# Altium schematic sheet RodManipulator_SCH.SchDoc
size A3
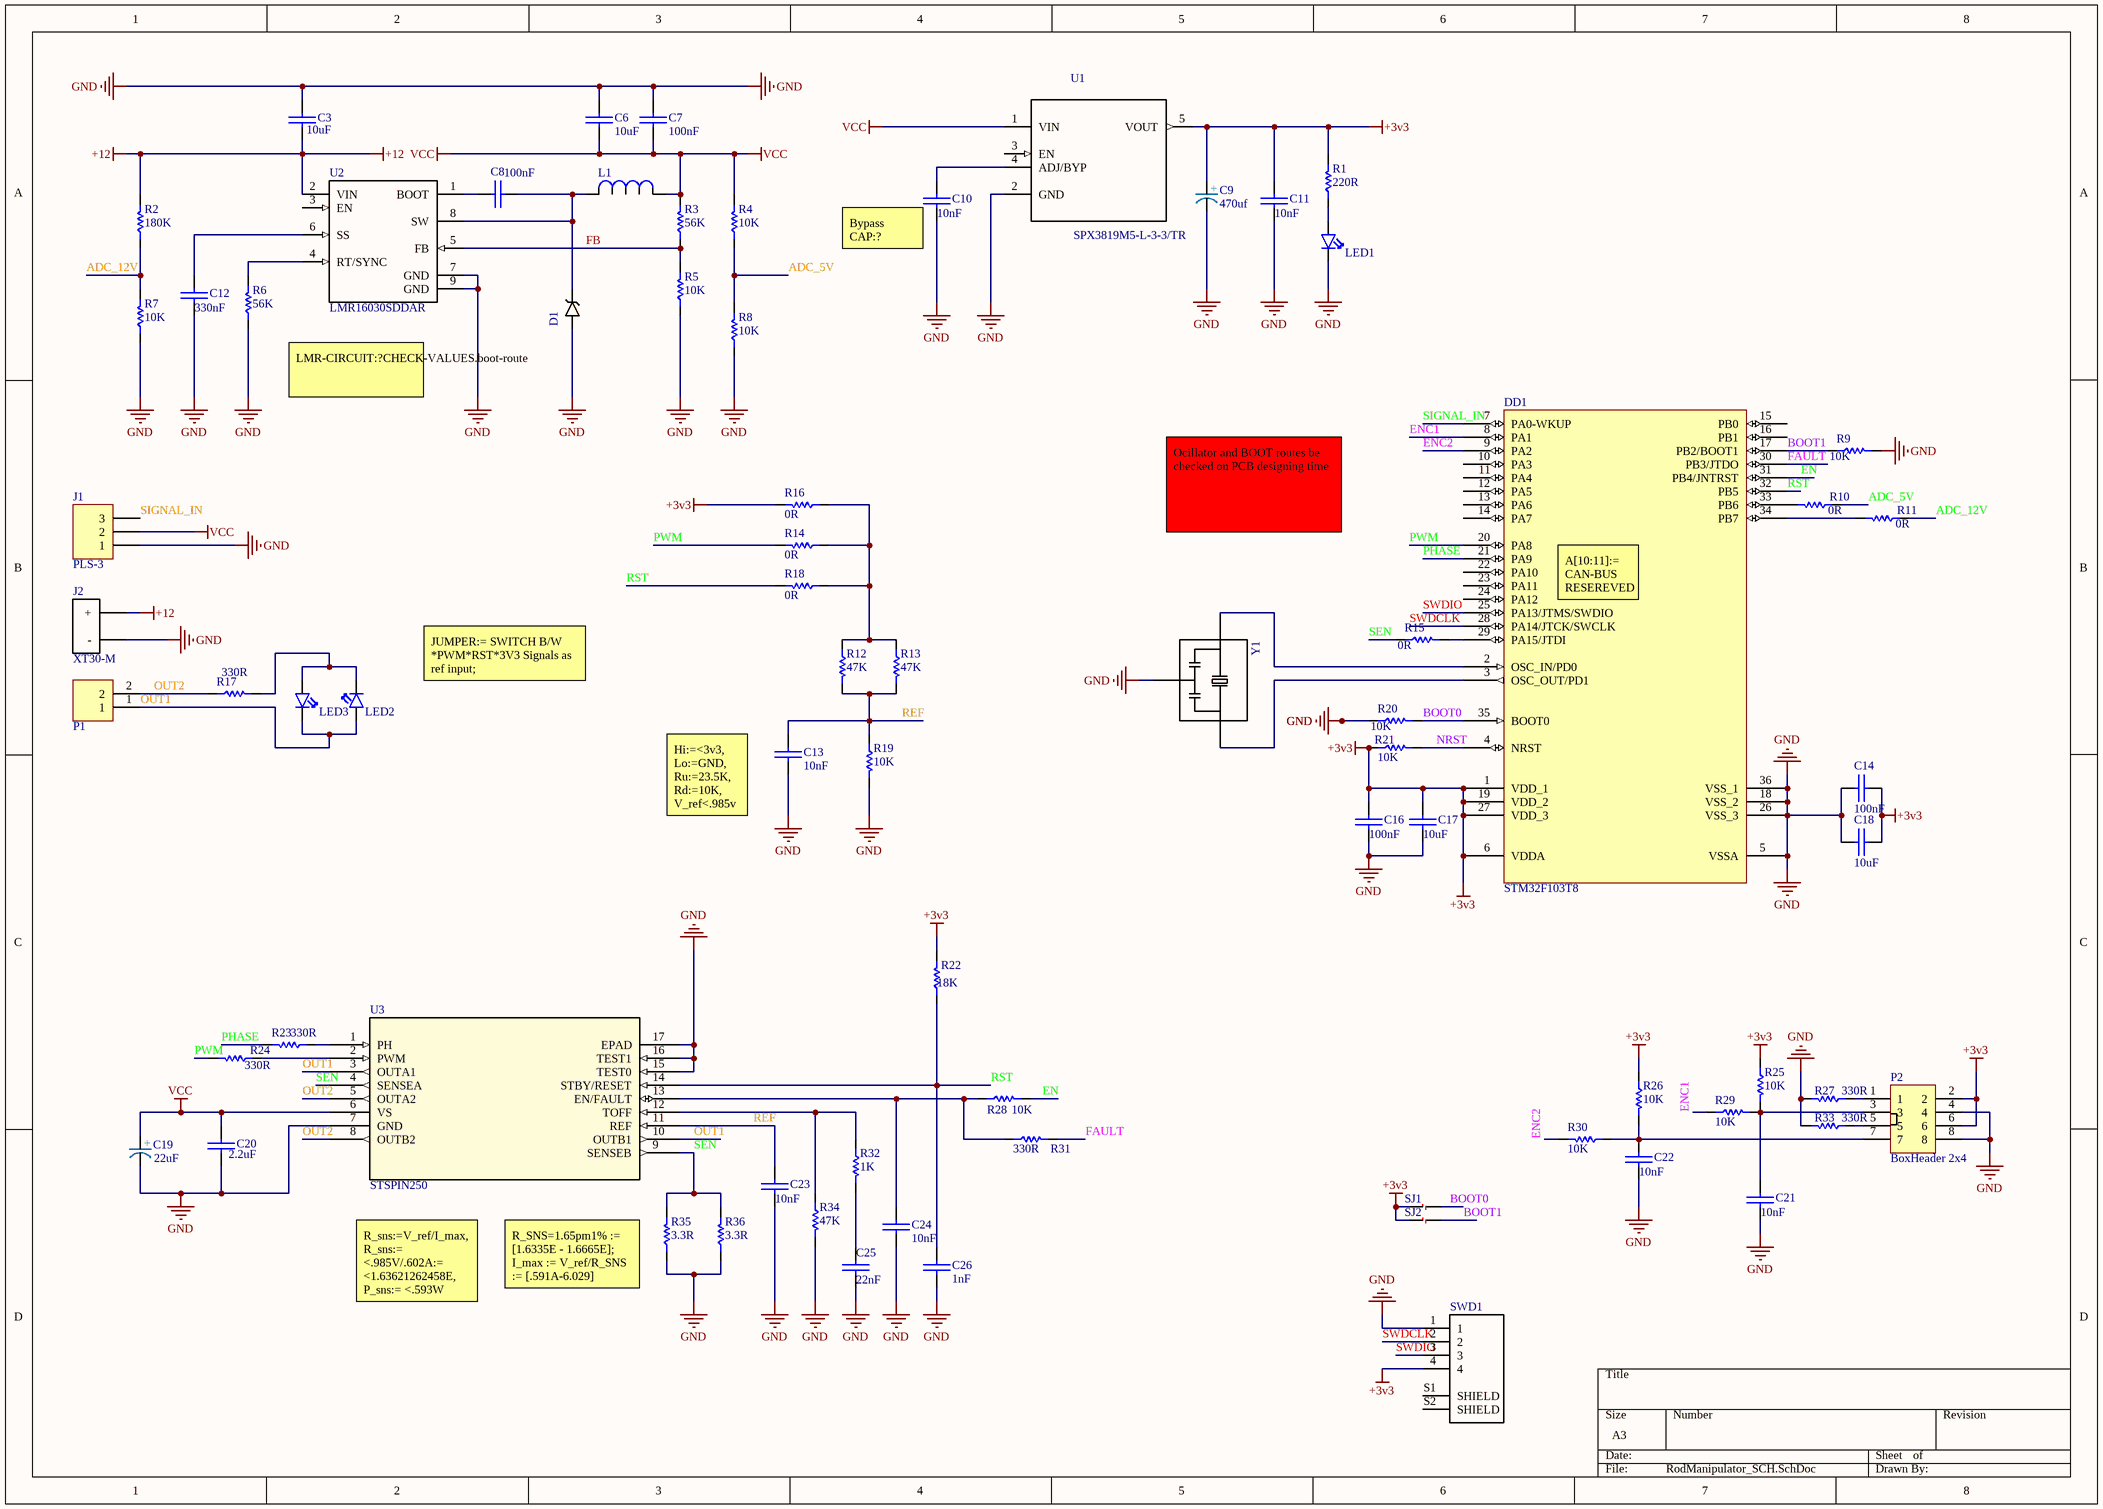
[diagram p0: RodManipulator_SCH.SchDoc]

## Parts
C3  10uF  [SMD_CAP_0603]
C6  10uF  [SMD_CAP_0603]
C7  100nF  [SMD_CAP_0603]
C8  100nF  [SMD_CAP_0603]
C9  470uf  [Tantalum Cap Size A - 1206]
C10  10nF  [SMD_CAP_0603]
C11  10nF  [SMD_CAP_0603]
C12  330nF  [SMD_CAP_0603]
C13  10nF  [SMD_CAP_0603]
C14  100nF  [SMD_CAP_0603]
C16  100nF  [SMD_CAP_0603]
C17  10uF  [SMD_CAP_0603]
C18  10uF  [SMD_CAP_0603]
C19  22uF  [Tantalum Cap Size A - 1206]
C20  2.2uF  [SMD_CAP_0603]
C21  10nF  [SMD_CAP_0603]
C22  10nF  [SMD_CAP_0603]
C23  10nF  [SMD_CAP_0603]
C24  10nF  [SMD_CAP_0603]
C25  22nF  [SMD_CAP_0603]
C26  1nF  [SMD_CAP_0603]
D1  SK56  [*SMB_P6SMB62AT3G(Primary)]  (value not drawn)
DD1  STM32F103T8  [*QFN50P600X600X100-37N]
J1  PLS-3  [HDR Side 3 pin]
J2  XT30-M  [XT30-M]
L1  IHLP2020BZER100M01  [IHLP]  (value not drawn)
LED1  LED  [LED0603]  (value not drawn)
LED2  LED  [LED0603]  (value not drawn)
LED3  LED  [LED0603]  (value not drawn)
P1  Connector  [PH Connector 2Pin]  (value not drawn)
P2  BoxHeader 2x4  [Box Header 2x4]
R1  220R  [RES 0603 (1608X06L)]
R2  180K  [RES 0603 (1608X06L)]
R3  56K  [RES 0603 (1608X06L)]
R4  10K  [RES 0603 (1608X06L)]
R5  10K  [RES 0603 (1608X06L)]
R6  56K  [RES 0603 (1608X06L)]
R7  10K  [RES 0603 (1608X06L)]
R8  10K  [RES 0603 (1608X06L)]
R9  10K  [RES 0603 (1608X06L)]
R10  0R  [RES 0603 (1608X06L)]
R11  0R  [RES 0603 (1608X06L)]
R12  47K  [RES 0603 (1608X06L)]
R13  47K  [RES 0603 (1608X06L)]
R14  0R  [RES 0603 (1608X06L)]
R15  0R  [RES 0603 (1608X06L)]
R16  0R  [RES 0603 (1608X06L)]
R17  330R  [RES 0603 (1608X06L)]
R18  0R  [RES 0603 (1608X06L)]
R19  10K  [RES 0603 (1608X06L)]
R20  10K  [RES 0603 (1608X06L)]
R21  10K  [RES 0603 (1608X06L)]
R22  18K  [RES 0603 (1608X06L)]
R23  330R  [RES 0603 (1608X06L)]
R24  330R  [RES 0603 (1608X06L)]
R25  10K  [RES 0603 (1608X06L)]
R26  10K  [RES 0603 (1608X06L)]
R27  330R  [RES 0603 (1608X06L)]
R28  10K  [RES 0603 (1608X06L)]
R29  10K  [RES 0603 (1608X06L)]
R30  10K  [RES 0603 (1608X06L)]
R31  330R  [RES 0603 (1608X06L)]
R32  1K  [RES 0603 (1608X06L)]
R33  330R  [RES 0603 (1608X06L)]
R34  47K  [RES 0603 (1608X06L)]
R35  3.3R  [RES 2010 (5026X08L)]
R36  3.3R  [RES 2010 (5026X08L)]
SJ1  SmdJumper  [RES 0603 (1608X06L)]  (value not drawn)
SJ2  SmdJumper  [RES 0603 (1608X06L)]  (value not drawn)
SWD1  SM04B-GHS-TB(LF)(SN)-  [JST_BM04B-GHS-holes]  (value not drawn)
U1  SPX3819M5-L-3-3/TR  [*SOT95P280X145-5N]
U2  LMR16030SDDAR  [*SOIC127P600X170-9N - duplicate]
U3  STSPIN250  [VFQFPN-16]
Y1  CSTCE8M00G55-R0  [*OSC_CSTCE8M00G55-R0]  (value not drawn)

## Nets
+3v3: C9.1 C11.2(-) C14.1(+) C16.1(+) C17.1(+) C18.1(+) DD1.1(VDD_1) DD1.6(VDDA) DD1.19(VDD_2) DD1.27(VDD_3) P2.2 P2.6 R1.2 R16.2 R21.1 R22.2 R25.1 R26.1 SJ1.2 SJ2.2 SWD1.4 U1.5(VOUT)
+12: C3.1(+) J2.PLUS(+) R2.2 U2.2(VIN)
GND: C3.2(-) C6.1(+) C7.2(-) C9.2 C10.1(+) C11.1(+) C12.2(-) C13.1(+) C14.2(-) C16.2(-) C17.2(-) C18.2(-) C19.2 C20.2(-) C21.1(+) C22.1(+) C23.2(-) C24.1(+) C25.2(-) C26.1(+) D1.A DD1.5(VSSA) DD1.18(VSS_2) DD1.26(VSS_3) DD1.36(VSS_1) J1.1 J2.MINUS(-) LED1.2(K) P2.4 P2.8 R5.1 R6.1 R7.1 R8.1 R9.2 R19.2 R20.1 R27.2 R33.2 R34.2 R35.1 R36.1 SWD1.1 U1.2(GND) U2.7(GND) U2.9(GND) U3.7(GND) U3.15(TEST0) U3.16(TEST1) U3.17(EPAD) Y1.2
VCC: C6.2(-) C7.1(+) C19.1 C20.1(+) J1.2 L1.1 R3.2 R4.2 U1.1(VIN) U3.6(VS)
ADC_5V: R4.1 R8.2 R10.1
ADC_12V: R2.1 R7.2 R11.1
BOOT0: DD1.35(BOOT0) R20.2 SJ1.1
BOOT1: DD1.17(PB2/BOOT1) R9.1 SJ2.1
EN: DD1.31(PB4/JNTRST) R28.2
ENC1: DD1.8(PA1) R29.1
ENC2: DD1.9(PA2) R30.2
FAULT: DD1.30(PB3/JTDO) R31.2
FB: R3.1 R5.2 U2.5(FB)
NRST: DD1.4(NRST) R21.2
OUT1: LED2.1(A) LED3.2(K) P1.1 U3.3(OUTA1) U3.10(OUTB1)
OUT2: P1.2 R17.1 U3.5(OUTA2) U3.8(OUTB2)
PHASE: DD1.21(PA9) R23.2
PWM: DD1.20(PA8) R14.2 R24.2
REF: C13.2(-) C23.1(+) R12.2 R13.2 R19.1 U3.11(REF)
RST: C26.2(-) DD1.32(PB5) R18.2 R22.1 U3.14(STBY/RESET)
SEN: R15.1 R35.2 R36.2 U3.4(SENSEA) U3.9(SENSEB)
SIGNAL_IN: DD1.7(PA0-WKUP) J1.3
SWDCLK: DD1.28(PA14/JTCK/SWCLK) SWD1.2
SWDIO: DD1.25(PA13/JTMS/SWDIO) SWD1.3
NetC8_1: C8.1(+) D1.C L1.2 U2.8(SW)
NetC8_2: C8.2(-) U2.1(BOOT)
NetC10_2: C10.2(-) U1.4(ADJ/BYP)
NetC12_1: C12.1(+) U2.6(SS)
NetC21_2: C21.2(-) P2.3 R25.2 R29.2
NetC22_2: C22.2(-) P2.7 R26.2 R30.1
NetC24_2: C24.2(-) R28.1 R31.1 U3.13(EN/FAULT)
NetC25_1: C25.1(+) R32.2
NetDD1_2: DD1.2(OSC_IN/PD0) Y1.1
NetDD1_3: DD1.3(OSC_OUT/PD1) Y1.3
NetDD1_29: DD1.29(PA15/JTDI) R15.2
NetDD1_33: DD1.33(PB6) R10.2
NetDD1_34: DD1.34(PB7) R11.2
NetLED1_1: LED1.1(A) R1.1
NetLED2_2: LED2.2(K) LED3.1(A) R17.2
NetP2_1: P2.1 R27.1
NetP2_5: P2.5 R33.1
NetR6_2: R6.2 U2.4(RT/SYNC)
NetR12_1: R12.1 R13.1 R14.1 R16.1 R18.1
NetR23_1: R23.1 U3.1(PH)
NetR24_1: R24.1 U3.2(PWM)
NetR32_1: R32.1 R34.1 U3.12(TOFF)

Not connected (* = marked no-connect by the designer): DD1 10(PA3) 11(PA4) 12(PA5) 13(PA6) 14(PA7) 15(PB0) 16(PB1) 22(PA10) 23(PA11) 24(PA12); SWD1 S1(SHIELD) S2(SHIELD); U1 3(EN); U2 3(EN)

## Notes on the sheet
- (near C10) Bypass CAP:?
- LMR-CIRCUIT:?CHECK-VALUES.boot-route
- Ocillator and BOOT routes be checked on PCB designing time
- (near DD1) A[10:11]:= CAN-BUS RESEREVED
- JUMPER:= SWITCH B/W *PWM*RST*3V3 Signals as ref input;
- (near C13) Hi:=<3v3, Lo:=GND, Ru:=23.5K, Rd:=10K, V_ref<.985v
- R_sns:=V_ref/I_max, R_sns:= <.985V/.602A:= <1.63621262458E, P_sns:= <.593W
- (near R35) R_SNS=1.65pm1% := [1.6335E - 1.6665E];  I_max := V_ref/R_SNS := [.591A-6.029]
- (in symbol Capacitor Polarized) +

## Library data of the parts
C3 C6-C8 C10-C14 C16-C18 C20-C26 = Cap-Bipolar: Bipolar Capacitor; Voltage: 100V; Designer: Saeid Jorablo; Organazation: ControTec; Adding Date: 1387/12/20
  C3 C6 C17 C18: Value: 10uF
  C7 C8 C14 C16: Value: 100nF
  C10 C11 C13 C21-C24: Value: 10nF
  C12: Value: 330nF
  C20: Value: 2.2uF
  C25: Value: 22nF
  C26: Value: 1nF
C9 = Capacitor Polarized: 470uf,16v; Designer: Hamed Jafarzadeh ( R2T )
C19 = Capacitor Polarized: Designer: Hamed Jafarzadeh ( R2T )
D1 = SK56: Диод Шоттки 5А 60В [SMB / DO-214AA]; MF: Littelfuse Inc.; Type: SMD; MP: SK56; Package: DO-214 Littelfuse; SnapEDA_Link: https://www.snapeda.com/parts/P6SMB62AT3G/Littelfuse%20Inc./view-part/?ref=snap; Value: *; ChipDip_Link: https://www.chipdip.ru/product/sk56
DD1 = STM32F103T8: STM32F103T8U6, Микроконтроллер 32BIT ARM 64K FLASH [VFQFPN-36]; MF: STM; ChipDip_Link: https://www.chipdip.ru/product/stm32f103t8u6-2; HelpURL: http://www.st.com/stonline/products/literature/ds/13587.pdf; MP: STM32F103T8U6; Package: VFQFPN-36; SnapEDA_Link: https://www.snapeda.com/parts/STM32F103T8U6TR/STMicroelectronics/view-part/?ref=search&t=STM32F103T8U6; Type: SMD
J1 = PLS-3: Header, 3-Pin; System: Connector; MF: Connfly electronic (Zhenqin); MP: PLS-3 (DS1021-1x3); Type: SMD; ChipDip_Link: https://www.chipdip.ru/product/pls-3; HelpURL: https://static.chipdip.ru/lib/227/DOC000227157.pdf
J2 = XT30-M: MP: XT60-M; MF: AMASS; Package: Package Analog Devices; Availability: Unavailable; SnapEDA_Link: https://www.snapeda.com/parts/XT60-M/AMASS/view-part/?ref=snap; Price: None; Value: *
L1 = IHLP2020BZER100M01: 10µH Shielded Molded Inductor 2.3A 199mOhm Max Nonstandard; Value: 10uH; MF: Vishay Dale; Type: SMD; SnapEDA_Link: https://www.snapeda.com/parts/IHLP2020BZER100M01/Vishay%20Dale/view-part/44808/?ref=snap; MP: IHLP2020BZER100M01; Package: Nonstandard Vishay; HelpURL: http://www.vishay.com/docs/34253/ihlp-2020bz-01.pdf; ChipDip_Link: https://www.chipdip.ru/product/ihlp2020bzer100m11-inductor-ihlp-smd-2020-10
LED1-LED3 = LED: Designer :: Razi Research Team Of Mashhad - Hamed Jafarzadeh
P1 = Connector 2Pin: Designer:: Hamed Jafarzadeh - www.R2T.ir
P2 = BoxHeader 2x4: Designer: HamedJafarzadeh - ww.R2T.ir
R1-R36 = Resistor: Tolerance: 5%; Power: 1/8 W
  R1: Value: 220R
  R2: Value: 180K
  R3 R6: Value: 56K
  R4 R5 R7-R9 R19-R21 R25 R26 R28-R30: Value: 10K
  R10 R11 R14-R16 R18: Value: 0R
  R12 R13 R34: Value: 47K
  R17 R23 R24 R27 R31 R33: Value: 330R
  R22: Value: 18K
  R32: Value: 1K
  R35 R36: Value: 3.3R
SWD1 = SWD SM04B-GHS-TB(LF)(SN)-: Conn Shrouded Header HDR 4 POS 1.25mm Solder ST SMD Reel; MF: JST Sales; Instructions: Do not install; System: Connector; SnapEDA_Link: https://www.snapeda.com/parts/BM04B-GHS-TBT%28LF%29%28SN%29%28N%29/JST%20Sales%20America%20Inc./view-part/?ref=snap; MP: SM04B-GHS-TB(LF)(SN); Package: None; Value: *; Type: SMD
U1 = SPX3819M5-L-3-3/TR: Low Dropout Voltage Regulator, Adjustable 0.5A, В±1%, 2.5 to 16 Vin, 5-Pin SOT-23 /; MF: MaxLinear, Inc.; Value: 3V3; MP: SPX3819M5-L-3-3/TR; Package: SOT-23-5 Exar; SnapEDA_Link: https://www.snapeda.com/parts/SPX3819M5-L/MaxLinear%2C%20Inc./view-part/?ref=snap; Type: SMD; ChipDip_Link: https://www.chipdip.ru/product1/8003455237; HelpURL: http://www.farnell.com/datasheets/2614478.pdf
U2 = LMR16030SDDAR: LMR16030SDDAR, Conv DC-DC 4.3V to 60V Step Down Single-Out 1V to 50V 3A Automotive 8-Pin HSOP EP T/R; MF: Texas Instruments; SnapEDA_Link: https://www.snapeda.com/parts/TPS54560DDA/Texas%20Instruments/view-part/?ref=snap; MP: LMR16030SDDAR; Package: PowerSOIC-8 Texas Instruments; Value: *; Type: SMD; ChipDip_Link: https://www.chipdip.ru/product1/8003448566; HelpURL: https://www.ti.com/lit/ds/symlink/lmr16030.pdf
U3 = STSPIN250: No Description Available; Manufacturer_Part_Number: STSPIN220; Vendor: STMicroelectronics; Built_By: Ehsan Shaghaei; SourceLibrary: Update_to_database_2020-12-04; Copyright: Copyright (C) 2018 Accelerated Designs. All rights reserved; RefDes: RefDes; Type: DEV
Y1 = CSTCE8M00G55-R0: Ceramic Resonator 8MHz ??0.5% _Tol_ ??0.2% _Stability_ 33pF 40Ohm 3-Pin CSMD T/R; MF: Murata; MP: CSTCE8M00G55-R0; Package: SMD-3 Murata; SnapEDA_Link: https://www.snapeda.com/parts/CSTCE8M00G55-R0/Murata%20Electronics%20North%20America/view-part/?ref=snap; Value: *; ChipDip_Link: https://www.chipdip.ru/product1/8001783721; HelpURL: https://www.murata.com/en-eu/api/pdfdownloadapi?cate=&partno=CSTCE8M00G55-R0; Type: SMD